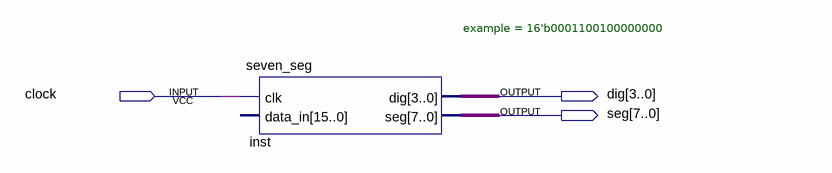
[diagram p0: schematic sheet]
// Quartus schematic test_seven_seg.bdf as structural Verilog: 1 symbols, 3 pins
module test_seven_seg (
  input  clock,
  output [3:0] dig,
  output [7:0] seg
);

  seven_seg #(.example(16'b0001100100000000)) inst (.clk(clock), .dig(dig), .seg(seg));  // open: data_in
endmodule
